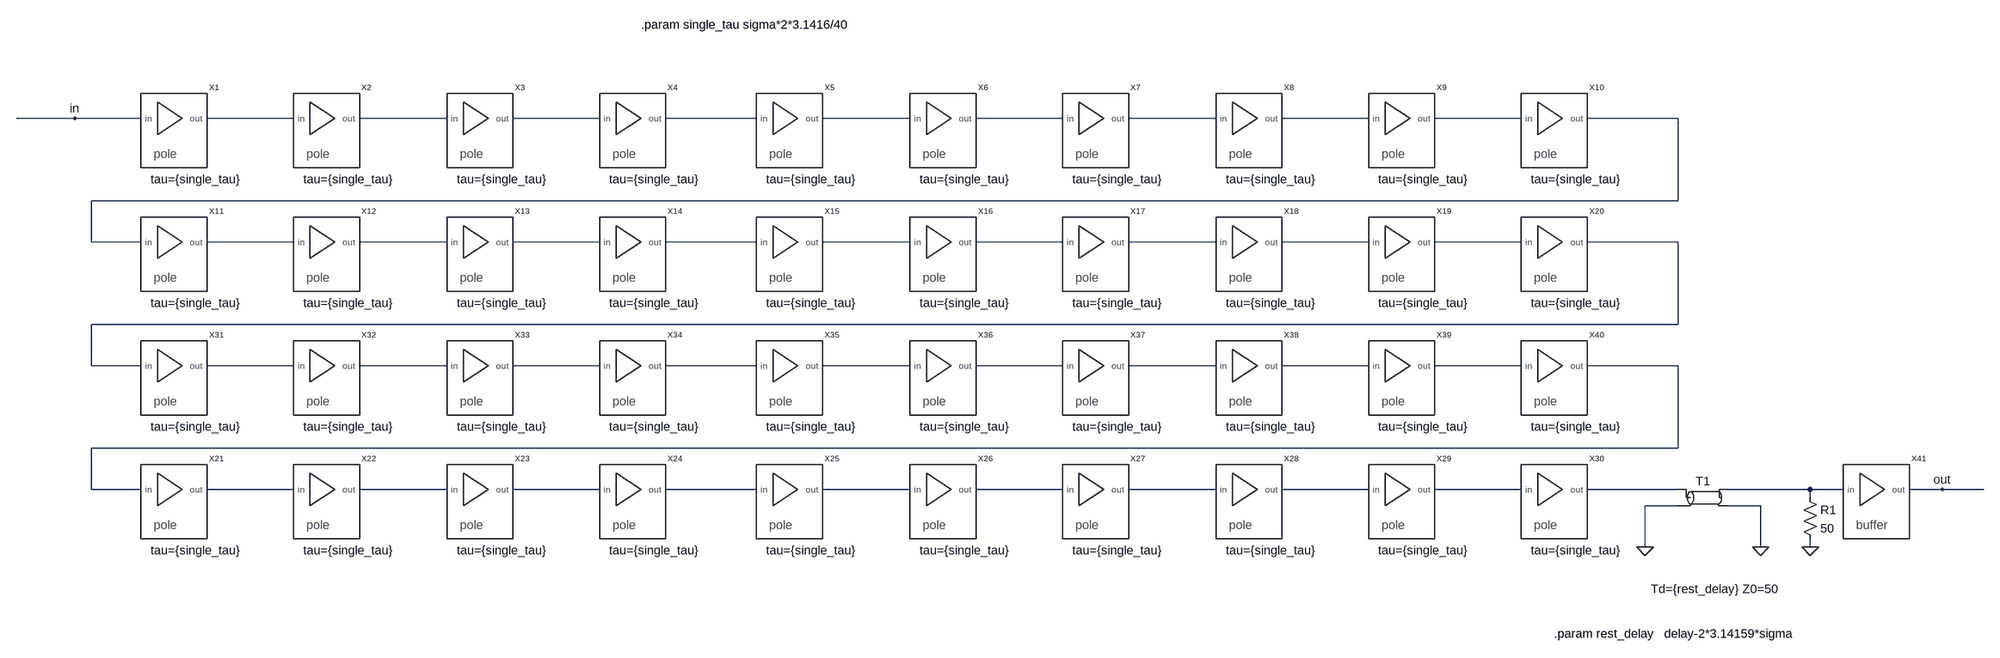
[diagram p0: schematic pseudogaussian_filter.asc]
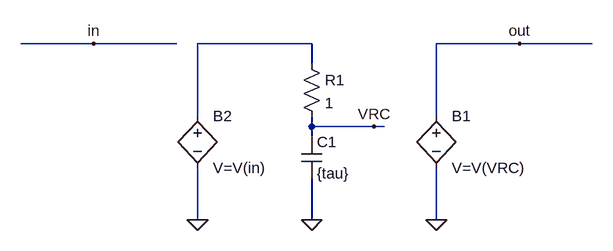
[diagram p1: sub-circuit ideal_pole.asc]
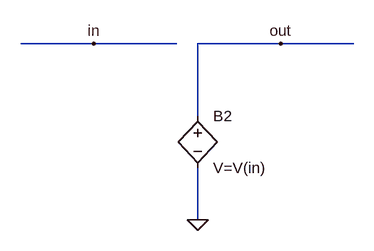
[diagram p2: sub-circuit ideal_buffer.asc]
pseudogaussian_filter.asc, the LTspice schematic file:
Version 4
SHEET 1 8388 4168
WIRE 4624 3088 4336 3088
WIRE 4752 3088 4624 3088
WIRE 5056 3088 4880 3088
WIRE 5360 3088 5184 3088
WIRE 5664 3088 5488 3088
WIRE 5968 3088 5792 3088
WIRE 6272 3088 6096 3088
WIRE 6576 3088 6400 3088
WIRE 6880 3088 6704 3088
WIRE 7184 3088 7008 3088
WIRE 7488 3088 7312 3088
WIRE 7792 3088 7616 3088
WIRE 7792 3248 7792 3088
WIRE 7792 3248 4656 3248
WIRE 4656 3328 4656 3248
WIRE 4752 3328 4656 3328
WIRE 5056 3328 4880 3328
WIRE 5360 3328 5184 3328
WIRE 5664 3328 5488 3328
WIRE 5968 3328 5792 3328
WIRE 6272 3328 6096 3328
WIRE 6576 3328 6400 3328
WIRE 6880 3328 6704 3328
WIRE 7184 3328 7008 3328
WIRE 7488 3328 7312 3328
WIRE 7792 3328 7616 3328
WIRE 7792 3488 7792 3328
WIRE 7792 3488 4656 3488
WIRE 4656 3568 4656 3488
WIRE 4752 3568 4656 3568
WIRE 5056 3568 4880 3568
WIRE 5360 3568 5184 3568
WIRE 5664 3568 5488 3568
WIRE 5968 3568 5792 3568
WIRE 6272 3568 6096 3568
WIRE 6576 3568 6400 3568
WIRE 6880 3568 6704 3568
WIRE 7184 3568 7008 3568
WIRE 7488 3568 7312 3568
WIRE 7792 3568 7616 3568
WIRE 7792 3728 7792 3568
WIRE 7792 3728 4656 3728
WIRE 4656 3808 4656 3728
WIRE 4752 3808 4656 3808
WIRE 5056 3808 4880 3808
WIRE 5360 3808 5184 3808
WIRE 5664 3808 5488 3808
WIRE 5968 3808 5792 3808
WIRE 6272 3808 6096 3808
WIRE 6576 3808 6400 3808
WIRE 6880 3808 6704 3808
WIRE 7184 3808 7008 3808
WIRE 7488 3808 7312 3808
WIRE 7792 3808 7616 3808
WIRE 8048 3808 7888 3808
WIRE 8112 3808 8048 3808
WIRE 8304 3808 8240 3808
WIRE 8384 3808 8304 3808
WIRE 8048 3824 8048 3808
WIRE 7792 3840 7728 3840
WIRE 7952 3840 7888 3840
WIRE 7728 3920 7728 3840
WIRE 7952 3920 7952 3840
WIRE 8048 3920 8048 3904
FLAG 8304 3808 out
FLAG 4624 3088 in
FLAG 7952 3920 0
FLAG 7728 3920 0
FLAG 8048 3920 0
SYMBOL ideal_pole 4816 3088 R0
SYMATTR SpiceLine tau={single_tau}
SYMATTR InstName X1
SYMBOL ideal_pole 5120 3088 R0
SYMATTR SpiceLine tau={single_tau}
SYMATTR InstName X2
SYMBOL ideal_pole 5424 3088 R0
SYMATTR SpiceLine tau={single_tau}
SYMATTR InstName X3
SYMBOL ideal_pole 5728 3088 R0
SYMATTR SpiceLine tau={single_tau}
SYMATTR InstName X4
SYMBOL ideal_pole 6032 3088 R0
SYMATTR SpiceLine tau={single_tau}
SYMATTR InstName X5
SYMBOL ideal_pole 6336 3088 R0
SYMATTR SpiceLine tau={single_tau}
SYMATTR InstName X6
SYMBOL ideal_pole 6640 3088 R0
SYMATTR SpiceLine tau={single_tau}
SYMATTR InstName X7
SYMBOL ideal_pole 6944 3088 R0
SYMATTR SpiceLine tau={single_tau}
SYMATTR InstName X8
SYMBOL ideal_pole 7248 3088 R0
SYMATTR SpiceLine tau={single_tau}
SYMATTR InstName X9
SYMBOL ideal_pole 7552 3088 R0
SYMATTR SpiceLine tau={single_tau}
SYMATTR InstName X10
SYMBOL ideal_pole 4816 3328 R0
SYMATTR SpiceLine tau={single_tau}
SYMATTR InstName X11
SYMBOL ideal_pole 5120 3328 R0
SYMATTR SpiceLine tau={single_tau}
SYMATTR InstName X12
SYMBOL ideal_pole 5424 3328 R0
SYMATTR SpiceLine tau={single_tau}
SYMATTR InstName X13
SYMBOL ideal_pole 5728 3328 R0
SYMATTR SpiceLine tau={single_tau}
SYMATTR InstName X14
SYMBOL ideal_pole 6032 3328 R0
SYMATTR SpiceLine tau={single_tau}
SYMATTR InstName X15
SYMBOL ideal_pole 6336 3328 R0
SYMATTR SpiceLine tau={single_tau}
SYMATTR InstName X16
SYMBOL ideal_pole 6640 3328 R0
SYMATTR SpiceLine tau={single_tau}
SYMATTR InstName X17
SYMBOL ideal_pole 6944 3328 R0
SYMATTR SpiceLine tau={single_tau}
SYMATTR InstName X18
SYMBOL ideal_pole 7248 3328 R0
SYMATTR SpiceLine tau={single_tau}
SYMATTR InstName X19
SYMBOL ideal_pole 7552 3328 R0
SYMATTR SpiceLine tau={single_tau}
SYMATTR InstName X20
SYMBOL ideal_pole 4816 3568 R0
SYMATTR SpiceLine tau={single_tau}
SYMATTR InstName X31
SYMBOL ideal_pole 5120 3568 R0
SYMATTR SpiceLine tau={single_tau}
SYMATTR InstName X32
SYMBOL ideal_pole 5424 3568 R0
SYMATTR SpiceLine tau={single_tau}
SYMATTR InstName X33
SYMBOL ideal_pole 5728 3568 R0
SYMATTR SpiceLine tau={single_tau}
SYMATTR InstName X34
SYMBOL ideal_pole 6032 3568 R0
SYMATTR SpiceLine tau={single_tau}
SYMATTR InstName X35
SYMBOL ideal_pole 6336 3568 R0
SYMATTR SpiceLine tau={single_tau}
SYMATTR InstName X36
SYMBOL ideal_pole 6640 3568 R0
SYMATTR SpiceLine tau={single_tau}
SYMATTR InstName X37
SYMBOL ideal_pole 6944 3568 R0
SYMATTR SpiceLine tau={single_tau}
SYMATTR InstName X38
SYMBOL ideal_pole 7248 3568 R0
SYMATTR SpiceLine tau={single_tau}
SYMATTR InstName X39
SYMBOL ideal_pole 7552 3568 R0
SYMATTR SpiceLine tau={single_tau}
SYMATTR InstName X40
SYMBOL ideal_pole 4816 3808 R0
SYMATTR SpiceLine tau={single_tau}
SYMATTR InstName X21
SYMBOL ideal_pole 5120 3808 R0
SYMATTR SpiceLine tau={single_tau}
SYMATTR InstName X22
SYMBOL ideal_pole 5424 3808 R0
SYMATTR SpiceLine tau={single_tau}
SYMATTR InstName X23
SYMBOL ideal_pole 5728 3808 R0
SYMATTR SpiceLine tau={single_tau}
SYMATTR InstName X24
SYMBOL ideal_pole 6032 3808 R0
SYMATTR SpiceLine tau={single_tau}
SYMATTR InstName X25
SYMBOL ideal_pole 6336 3808 R0
SYMATTR SpiceLine tau={single_tau}
SYMATTR InstName X26
SYMBOL ideal_pole 6640 3808 R0
SYMATTR SpiceLine tau={single_tau}
SYMATTR InstName X27
SYMBOL ideal_pole 6944 3808 R0
SYMATTR SpiceLine tau={single_tau}
SYMATTR InstName X28
SYMBOL ideal_pole 7248 3808 R0
SYMATTR SpiceLine tau={single_tau}
SYMATTR InstName X29
SYMBOL ideal_pole 7552 3808 R0
SYMATTR SpiceLine tau={single_tau}
SYMATTR InstName X30
SYMBOL tline 7840 3824 R0
WINDOW 3 23 162 Top 2
SYMATTR Value Td={rest_delay} Z0=50
SYMATTR InstName T1
SYMBOL ideal_buffer 8176 3808 R0
SYMATTR InstName X41
SYMBOL res 8032 3808 R0
SYMATTR InstName R1
SYMATTR Value 50
TEXT 5744 2896 Left 2 !.param single_tau sigma*2*3.1416/40
TEXT 7552 4088 Left 2 !.param rest_delay   delay-2*3.14159*sigma

ideal_pole.asc, the sub-circuit schematic file:
Version 4
SHEET 1 2652 680
WIRE 528 32 416 32
WIRE 656 32 528 32
WIRE 864 32 688 32
WIRE 1184 32 1056 32
WIRE 1296 32 1184 32
WIRE 864 64 864 32
WIRE 688 144 688 32
WIRE 1056 144 1056 32
WIRE 864 160 864 144
WIRE 960 160 864 160
WIRE 976 160 960 160
WIRE 864 176 864 160
WIRE 688 304 688 224
WIRE 864 304 864 240
WIRE 1056 304 1056 224
FLAG 688 304 0
FLAG 528 32 in
FLAG 1056 304 0
FLAG 1184 32 out
FLAG 864 304 0
FLAG 960 160 VRC
SYMBOL bv 688 128 R0
SYMATTR InstName B2
SYMATTR Value V=V(in)
SYMBOL bv 1056 128 R0
SYMATTR InstName B1
SYMATTR Value V=V(VRC)
SYMBOL res 848 48 R0
SYMATTR InstName R1
SYMATTR Value 1
SYMBOL cap 848 176 R0
SYMATTR InstName C1
SYMATTR Value {tau}

ideal_buffer.asc, the sub-circuit schematic file:
Version 4
SHEET 1 2652 680
WIRE 528 32 416 32
WIRE 656 32 528 32
WIRE 816 32 688 32
WIRE 928 32 816 32
WIRE 688 144 688 32
WIRE 688 304 688 224
FLAG 688 304 0
FLAG 528 32 in
FLAG 816 32 out
SYMBOL bv 688 128 R0
SYMATTR InstName B2
SYMATTR Value V=V(in)

The netlist it stands for:
* pseudogaussian_filter.asc
XX1 in N001 ideal_pole params: tau={single_tau}
XX2 N001 N002 ideal_pole params: tau={single_tau}
XX3 N002 N003 ideal_pole params: tau={single_tau}
XX4 N003 N004 ideal_pole params: tau={single_tau}
XX5 N004 N005 ideal_pole params: tau={single_tau}
XX6 N005 N006 ideal_pole params: tau={single_tau}
XX7 N006 N007 ideal_pole params: tau={single_tau}
XX8 N007 N008 ideal_pole params: tau={single_tau}
XX9 N008 N009 ideal_pole params: tau={single_tau}
XX10 N009 N010 ideal_pole params: tau={single_tau}
XX11 N010 N011 ideal_pole params: tau={single_tau}
XX12 N011 N012 ideal_pole params: tau={single_tau}
XX13 N012 N013 ideal_pole params: tau={single_tau}
XX14 N013 N014 ideal_pole params: tau={single_tau}
XX15 N014 N015 ideal_pole params: tau={single_tau}
XX16 N015 N016 ideal_pole params: tau={single_tau}
XX17 N016 N017 ideal_pole params: tau={single_tau}
XX18 N017 N018 ideal_pole params: tau={single_tau}
XX19 N018 N019 ideal_pole params: tau={single_tau}
XX20 N019 N020 ideal_pole params: tau={single_tau}
XX31 N020 N021 ideal_pole params: tau={single_tau}
XX32 N021 N022 ideal_pole params: tau={single_tau}
XX33 N022 N023 ideal_pole params: tau={single_tau}
XX34 N023 N024 ideal_pole params: tau={single_tau}
XX35 N024 N025 ideal_pole params: tau={single_tau}
XX36 N025 N026 ideal_pole params: tau={single_tau}
XX37 N026 N027 ideal_pole params: tau={single_tau}
XX38 N027 N028 ideal_pole params: tau={single_tau}
XX39 N028 N029 ideal_pole params: tau={single_tau}
XX40 N029 N030 ideal_pole params: tau={single_tau}
XX21 N030 N031 ideal_pole params: tau={single_tau}
XX22 N031 N032 ideal_pole params: tau={single_tau}
XX23 N032 N033 ideal_pole params: tau={single_tau}
XX24 N033 N034 ideal_pole params: tau={single_tau}
XX25 N034 N035 ideal_pole params: tau={single_tau}
XX26 N035 N036 ideal_pole params: tau={single_tau}
XX27 N036 N037 ideal_pole params: tau={single_tau}
XX28 N037 N038 ideal_pole params: tau={single_tau}
XX29 N038 N039 ideal_pole params: tau={single_tau}
XX30 N039 N040 ideal_pole params: tau={single_tau}
T1 N040 0 N041 0 Td={rest_delay} Z0=50
XX41 N041 out ideal_buffer
R1 N041 0 50

* block symbol definitions
.subckt ideal_pole in out
B2 N001 0 V=V(in)
B1 out 0 V=V(VRC)
R1 N001 VRC 1
C1 VRC 0 {tau}
.ends ideal_pole

.subckt ideal_buffer in out
B2 out 0 V=V(in)
.ends ideal_buffer

.param single_tau sigma*2*3.1416/40
.param rest_delay   delay-2*3.14159*sigma
.backanno
.end